# Altium project LEGO_SpeedChampion_Controller.PrjPcb
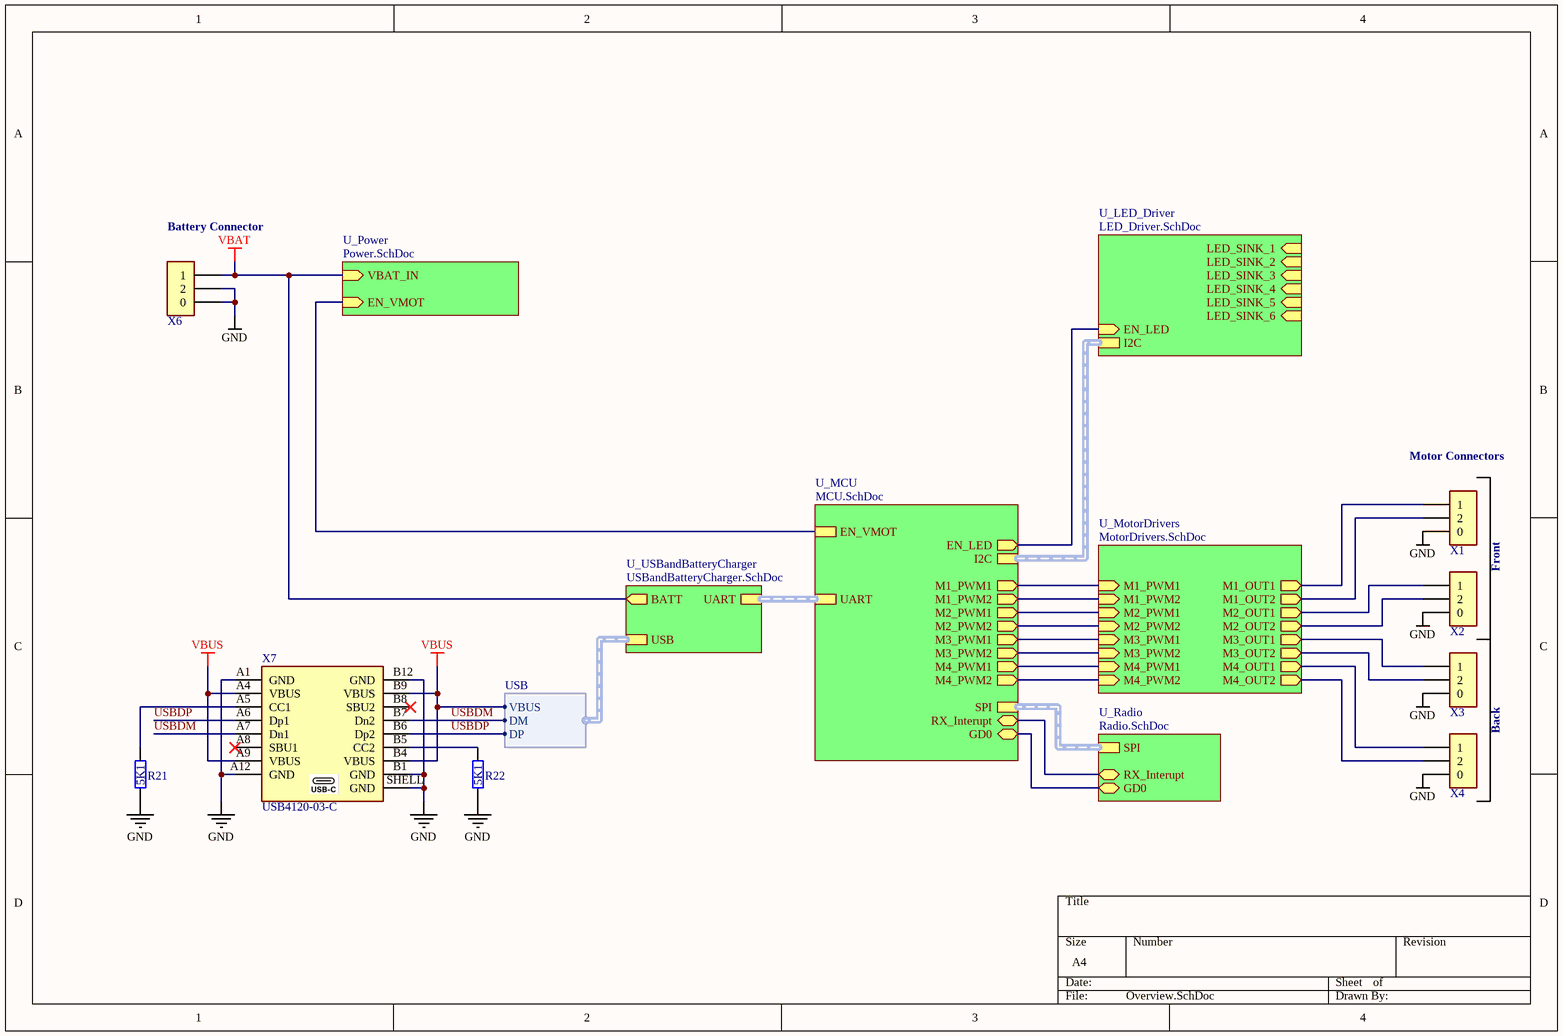
[diagram p0: Overview.SchDoc]
7 sheets, 105 parts. Net scope: hierarchical (ports join the sheet entries above them; power ports are global).
Board file: PCB.PcbDoc
Sheets:
  Overview.SchDoc
    U_Radio = Radio.SchDoc
    U_MCU = MCU.SchDoc
    U_Power = Power.SchDoc
    U_USBandBatteryCharger = USBandBatteryCharger.SchDoc
    U_MotorDrivers = MotorDrivers.SchDoc
    U_LED_Driver = LED_Driver.SchDoc

## Sheet Overview.SchDoc
size A4; SheetNumber: 1; SheetTotal: 7

### Parts
R21  5K1  [0603]  (value not drawn)
R22  5K1  [0603]  (value not drawn)
X1  BM02B-SRSS-TB  [BM02B-SRSS-TB]  (value not drawn)
X2  BM02B-SRSS-TB  [BM02B-SRSS-TB]  (value not drawn)
X3  BM02B-SRSS-TB  [BM02B-SRSS-TB]  (value not drawn)
X4  BM02B-SRSS-TB  [BM02B-SRSS-TB]  (value not drawn)
X6  BM02B-SRSS-TB  [BM02B-SRSS-TB]  (value not drawn)
X7  USB4120-03-C  [USB4120]

### Sub-sheets
U_LED_Driver = LED_Driver.SchDoc: LED_SINK_1 (in), LED_SINK_2 (in), LED_SINK_3 (in), LED_SINK_4 (in), LED_SINK_5 (in), LED_SINK_6 (in), EN_LED (in), I2C (harness I2C)
U_MCU = MCU.SchDoc: SPI (harness SPI), UART (harness UART), M1_PWM1 (out), M1_PWM2 (out), M2_PWM1 (out), M2_PWM2 (out), M3_PWM1 (out), M3_PWM2 (out), M4_PWM1 (out), M4_PWM2 (out), EN_VMOT, RX_Interupt (bidir), GD0 (bidir), I2C, EN_LED (out)
U_MotorDrivers = MotorDrivers.SchDoc: M1_PWM1 (in), M1_PWM2 (in), M2_PWM1 (in), M2_PWM2 (in), M3_PWM1 (in), M3_PWM2 (in), M4_PWM1 (in), M4_PWM2 (in), M1_OUT1 (out), M1_OUT2 (out), M2_OUT1 (out), M2_OUT2 (out), M3_OUT1 (out), M3_OUT2 (out), M4_OUT1 (out), M4_OUT2 (out)
U_Power = Power.SchDoc: VBAT_IN (in), EN_VMOT (in)
U_Radio = Radio.SchDoc: SPI (harness SPI), RX_Interupt (bidir), GD0 (bidir)
U_USBandBatteryCharger = USBandBatteryCharger.SchDoc: UART (harness UART), USB (harness USB), BATT (out)

### Harnesses
USB: VBUS, DP, DM

### Nets
GND: R21.1 R22.1 X1.0 X2.0 X3.0 X4.0 X6.0 X6.2 X7.A1(GND) X7.A12(GND) X7.B1(GND) X7.B12(GND) X7.SHELL(GND)
VBAT: X6.1 ; sheet U_Power/VBAT_IN, sheet U_USBandBatteryCharger/BATT
VBUS: X7.A4(VBUS) X7.A9(VBUS) X7.B4(VBUS) X7.B9(VBUS) ; sheet U_USBandBatteryCharger/USB.VBUS
M1_IN1: sheet U_MCU/M1_PWM1, sheet U_MotorDrivers/M1_PWM1
M1_IN2: sheet U_MCU/M1_PWM2, sheet U_MotorDrivers/M1_PWM2
M2_IN1: sheet U_MCU/M2_PWM1, sheet U_MotorDrivers/M2_PWM1
M2_IN2: sheet U_MCU/M2_PWM2, sheet U_MotorDrivers/M2_PWM2
M3_IN1: sheet U_MCU/M3_PWM1, sheet U_MotorDrivers/M3_PWM1
M3_IN2: sheet U_MCU/M3_PWM2, sheet U_MotorDrivers/M3_PWM2
M4_IN1: sheet U_MCU/M4_PWM1, sheet U_MotorDrivers/M4_PWM1
M4_IN2: sheet U_MCU/M4_PWM2, sheet U_MotorDrivers/M4_PWM2
USBDM: X7.A7(Dn1) X7.B7(Dn2) ; sheet U_USBandBatteryCharger/USB.DM
USBDP: X7.A6(Dp1) X7.B6(Dp2) ; sheet U_USBandBatteryCharger/USB.DP
NetIC1_2: X1.2 ; sheet U_MotorDrivers/M1_OUT2
NetIC1_3: X1.1 ; sheet U_MotorDrivers/M1_OUT1
NetIC2_2: X2.2 ; sheet U_MotorDrivers/M2_OUT2
NetIC2_3: X2.1 ; sheet U_MotorDrivers/M2_OUT1
NetIC3_2: X3.2 ; sheet U_MotorDrivers/M3_OUT2
NetIC3_3: X3.1 ; sheet U_MotorDrivers/M3_OUT1
NetIC4_2: X4.2 ; sheet U_MotorDrivers/M4_OUT2
NetIC4_3: X4.1 ; sheet U_MotorDrivers/M4_OUT1
NetIC5_3: sheet U_Radio/RX_Interupt, sheet U_MCU/RX_Interupt
NetIC5_6: sheet U_Radio/GD0, sheet U_MCU/GD0
NetIC6_1: sheet U_MCU/EN_VMOT, sheet U_Power/EN_VMOT
NetIC6_20: sheet U_MCU/EN_LED, sheet U_LED_Driver/EN_LED
NetR21_2: R21.2 X7.A5(CC1)
NetR22_2: R22.2 X7.B5(CC2)

Not connected (* = marked no-connect by the designer): X7 A8(SBU1)* B8(SBU2)*

### Buses and harness runs
harness sheet U_LED_Driver/I2C = sheet U_MCU/I2C
harness sheet U_MCU/SPI = sheet U_Radio/SPI
harness sheet U_MCU/UART = sheet U_USBandBatteryCharger/UART

### Notes on the sheet
- (near X6) Battery Connector
- (near X1) Motor Connectors
- Front
- Back

### Library data of the parts
R21 R22 = 000053: Part Number: 000053; Manufacturer: YAGEO; Manufacturer Partnummber: RC0603FR-075K1L; =Value: 10K; Component Type: Standard; ComponentLink1Description: Datasheet; ComponentLink2Description: Manufacturer Site; Value: 5K1; JLCPCB Part #: C23196
X1-X4 X6 = BM02B-SRSS-TB: Manufacturer: JST; Manufacturer Partnummber: BM02B-SRSS-TB
X7 = USB4120-03-C: Manufacturer: GCT; Manufacturer Partnummber: USB4120-03-C

## Sheet Radio.SchDoc
size A4; SheetNumber: 3; SheetTotal: 7
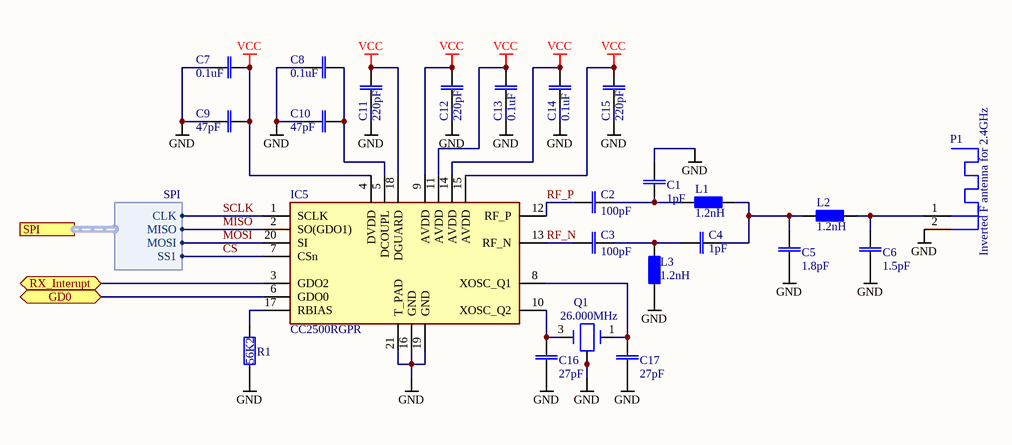
[diagram p1: Radio.SchDoc]

### Parts
C1  1pF  [CAP0402]
C2  100pF  [CAP0402]
C3  100pF  [CAP0402]
C4  1pF  [CAP0402]
C5  1.8pF  [CAP0402]
C6  1.5pF  [CAP0402]
C7  0.1uF  [CAP0402]
C8  0.1uF  [CAP0402]
C9  47pF  [CAP0402]
C10  47pF  [CAP0402]
C11  220pF  [CAP0402]
C12  220pF  [CAP0402]
C13  0.1uF  [CAP0402]
C14  0.1uF  [CAP0402]
C15  220pF  [CAP0402]
C16  27pF  [CAP0402]
C17  27pF  [CAP0402]
IC5  CC2500RGPR  [QFN20_4X4(CC2500)]
L1  1.2nH  [IND0402]
L2  1.2nH  [IND0402]
L3  1.2nH  [IND0402]
P1  Inverted F antenna for 2.4GHz  [Inverted_F_Antenna_2400MHZ]  (net tie, no BOM)
Q1  26.000MHz  [OSCCC322507]
R1  56K2  [RES0402]  (value not drawn)

### Ports
GD0 (bidir), RX_Interupt (bidir), SPI (harness SPI)

### Harnesses
SPI: MOSI, MISO, CLK, SS1

### Nets
GND: C1.1 C5.2 C6.2 C7.1 C8.1 C9.1 C10.1 C11.1 C12.1 C13.1 C14.1 C15.1 C16.2 C17.2 IC5.16(GND) IC5.19(GND) IC5.21(T_PAD) L3.1 P1.2(REF) Q1.2 Q1.4 R1.1
VCC: C7.2 C9.2 C11.2 C12.2 C13.2 C14.2 C15.2 IC5.4(DVDD) IC5.9(AVDD) IC5.11(AVDD) IC5.14(AVDD) IC5.15(AVDD) IC5.18(DGUARD)
CS: IC5.7(CSn) ; port SPI.SS1
MISO: IC5.2(SO(GDO1)) ; port SPI.MISO
MOSI: IC5.20(SI) ; port SPI.MOSI
RF_N: C3.1 IC5.13(RF_N)
RF_P: C2.1 IC5.12(RF_P)
SCLK: IC5.1(SCLK) ; port SPI.CLK
NetC1_2: C1.2 C2.2 L1.1
NetC3_2: C3.2 C4.2 L3.2
NetC4_1: C4.1 C5.1 L1.2 L2.1
NetC6_1: C6.1 L2.2 P1.1(FEED)
NetC8_2: C8.2 C10.2 IC5.5(DCOUPL)
NetC16_1: C16.1 IC5.10(XOSC_Q2) Q1.3
NetC17_1: C17.1 IC5.8(XOSC_Q1) Q1.1
NetIC5_3: IC5.3(GDO2) ; port RX_Interupt
NetIC5_6: IC5.6(GDO0) ; port GD0
NetIC5_17: IC5.17(RBIAS) R1.2

### Library data of the parts
C1 C4 = CAP_0402: Manufacturer: Samsung Electro-Mechanics; Manufacturer Partnummber: CL05C010CB5NNNC; Value: 1pF
C2 C3 = CAP_0402: Manufacturer: Samsung Electro-Mechanics; Manufacturer Partnummber: CL05C101JB5NNNC; Value: 100pF
C5 = CAP_0402: Manufacturer: Samsung Electro-Mechanics; Manufacturer Partnummber: CL05C1R8CC51PNC; Value: 1.8pF
C6 = CAP_0402: Manufacturer: Samsung Electro-Mechanics; Manufacturer Partnummber: CL05C1R5BB5NNNC; Value: 1.5pF
C7 C8 C13 C14 = CAP_0402: Manufacturer: Samsung Electro-Mechanics; Manufacturer Partnummber: CL05A104KA5NNNC; Value: 0.1uF
C9 C10 = CAP_0402: Manufacturer: Samsung Electro-Mechanics; Manufacturer Partnummber: CL05C470JB5NNNC; Value: 47pF
C11 C12 C15 = CAP_0402: Manufacturer: Samsung Electro-Mechanics; Manufacturer Partnummber: CL05C221JB5NNNC; Value: 220pF
C16 C17 = CAP_0402: Manufacturer: Samsung Electro-Mechanics; Manufacturer Partnummber: CL05C270JB5NNNC; Value: 27pF
IC5 = CC2500: Manufacturer: Texas Instruments; Manufacturer Partnummber: CC2500RGPR
L1-L3 = IND_0402: Manufacturer: Abracon LLC; Manufacturer Partnummber: ATFC-0402-1N2B-T; Value: 1.2nH
P1 = Antenna F 2400MHz
Q1 = ABM8G-26.000MHZ-18-D2Y-T: Manufacturer: Abracon LLC; Manufacturer Partnummber: ABM8G-26.000MHZ-18-D2Y-T
R1 = RES_0402: Manufacturer: YAGEO; Manufacturer Partnummber: RC0402FR-0756K2L; Value: 56K2

## Sheet MCU.SchDoc
size A4; SheetNumber: 2; SheetTotal: 7
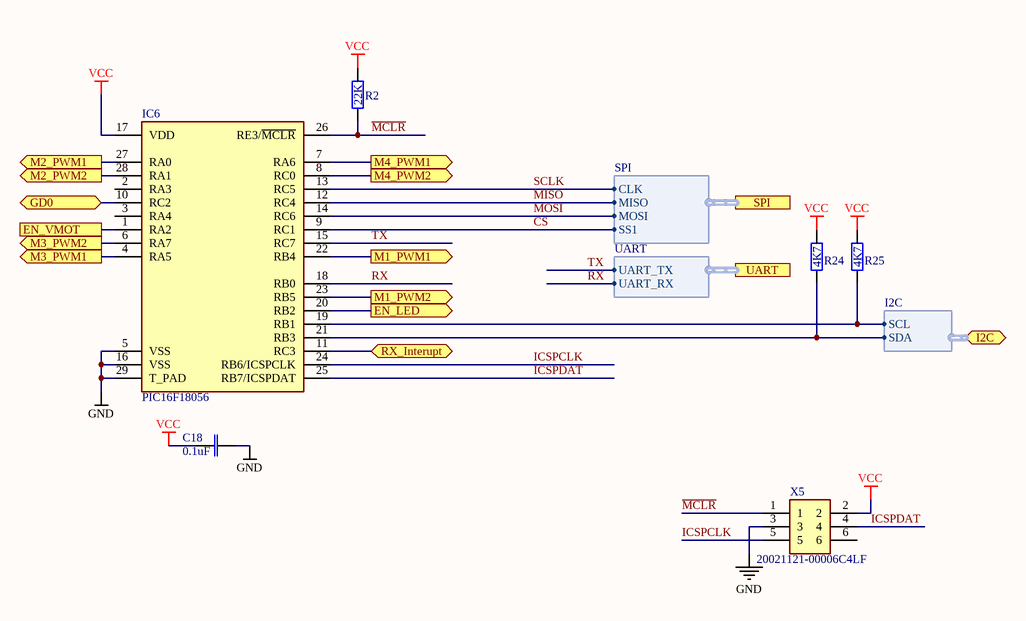
[diagram p2: MCU.SchDoc]

### Parts
C18  0.1uF  [CAP0402]
IC6  PIC16F18056  [QFN28_4X4(PIC16F18056)]
R2  22K  [RES0402]  (value not drawn)
R24  4K7  [RES0402]  (value not drawn)
R25  4K7  [RES0402]  (value not drawn)
X5  20021121-00006C4LF  [20021121-00X06CXLF]

### Ports
EN_LED (out), EN_VMOT, GD0 (bidir), I2C (bidir, harness I2C), M1_PWM1 (out), M1_PWM2 (out), M2_PWM1 (out), M2_PWM2 (out), M3_PWM1 (out), M3_PWM2 (out), M4_PWM1 (out), M4_PWM2 (out), RX_Interupt (bidir), SPI (harness SPI), UART (harness UART)

### Harnesses
SPI: MOSI, MISO, CLK, SS1
UART: UART_TX, UART_RX
I2C: SCL, SDA

### Nets
GND: C18.2 IC6.5(VSS) IC6.16(VSS) IC6.29(T_PAD) X5.3
VCC: C18.1 IC6.17(VDD) R2.2 R24.2 R25.2 X5.2
CS: IC6.9(RC1) ; port SPI.SS1
ICSPCLK: IC6.24(RB6/ICSPCLK) X5.5
ICSPDAT: IC6.25(RB7/ICSPDAT) X5.4
M1_IN1: IC6.22(RB4) ; port M1_PWM1
M1_IN2: IC6.23(RB5) ; port M1_PWM2
M2_IN1: IC6.27(RA0) ; port M2_PWM1
M2_IN2: IC6.28(RA1) ; port M2_PWM2
M3_IN1: IC6.4(RA5) ; port M3_PWM1
M3_IN2: IC6.6(RA7) ; port M3_PWM2
M4_IN1: IC6.7(RA6) ; port M4_PWM1
M4_IN2: IC6.8(RC0) ; port M4_PWM2
~{MCLR}: IC6.26(RE3/~{MCLR}) R2.1 X5.1
MISO: IC6.12(RC4) ; port SPI.MISO
MOSI: IC6.14(RC6) ; port SPI.MOSI
RX: IC6.18(RB0) ; port UART.UART_RX
SCLK: IC6.13(RC5) ; port SPI.CLK
TX: IC6.15(RC7) ; port UART.UART_TX
NetIC5_3: IC6.11(RC3) ; port RX_Interupt
NetIC5_6: IC6.10(RC2) ; port GD0
NetIC6_1: IC6.1(RA2) ; port EN_VMOT
NetIC6_19: IC6.19(RB1) R25.1 ; port I2C.SCL
NetIC6_20: IC6.20(RB2) ; port EN_LED
NetIC6_21: IC6.21(RB3) R24.1 ; port I2C.SDA

Not connected (* = marked no-connect by the designer): IC6 2(RA3) 3(RA4); X5 6

### Library data of the parts
C18 = CAP_0402: as C7 on sheet Radio; Value: 0.1uF
IC6 = PIC16F18056: Manufacturer: Microchip Technology; Manufacturer Partnummber: PIC16F18056-I/STX
R2 = RES_0402: Manufacturer: YAGEO; Manufacturer Partnummber: RC0402FR-0722KL; Value: 22K
R24 R25 = RES_0402: Manufacturer: YAGEO; Manufacturer Partnummber: RC0402FR-074K7L; Value: 4K7
X5 = 20021121-00006C4LF: Manufacturer: Amphenol ICC (FCI); JLCPCB Part #: C178291; Manufacturer Partnummber: 20021121-00006C4LF

## Sheet Power.SchDoc
size A4; SheetNumber: 4; SheetTotal: 7
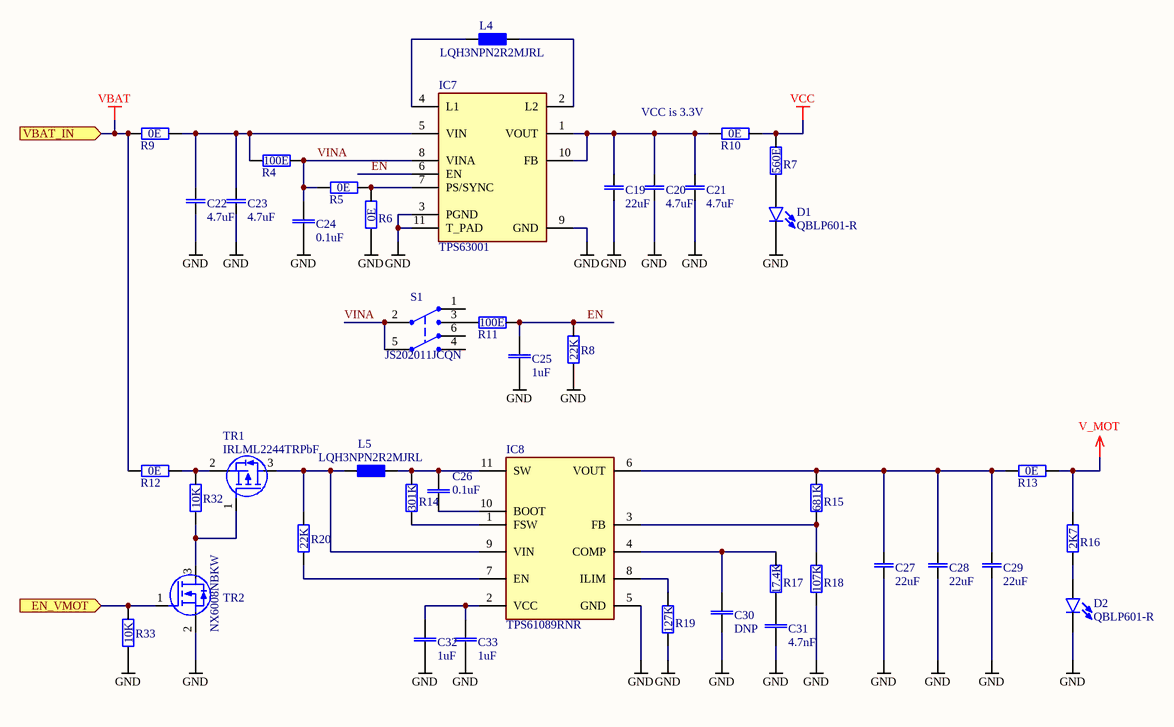
[diagram p3: Power.SchDoc]

### Parts
C19  22uF  [0805]
C20  4.7uF  [0805]
C21  4.7uF  [0805]
C22  4.7uF  [0805]
C23  4.7uF  [0805]
C24  0.1uF  [CAP0402]
C25  1uF  [CAP0402]
C26  0.1uF  [CAP0402]
C27  22uF  [0805]
C28  22uF  [0805]
C29  22uF  [0805]
C30  DNP  [CAP0402]
C31  4.7nF  [CAP0402]
C32  1uF  [CAP0402]
C33  1uF  [CAP0402]
D1  QBLP601-R  [LED0603]
D2  QBLP601-R  [LED0603]
IC7  TPS63001  [VSON10(TPS63001)]
IC8  TPS61089RNR  [VQFN12_HOTROD(TPS61089)]
L4  LQH3NPN2R2MJRL  [INDP3030X02N]
L5  LQH3NPN2R2MJRL  [INDP3030X02N]
R4  100E  [RES0402]  (value not drawn)
R5  0E  [RES0402]  (value not drawn)
R6  0E  [RES0402]  (value not drawn)
R7  560E  [RES0402]  (value not drawn)
R8  22K  [RES0402]  (value not drawn)
R9  0E  [RES0402]  (value not drawn)
R10  0E  [RES0402]  (value not drawn)
R11  100E  [RES0402]  (value not drawn)
R12  0E  [RES0402]  (value not drawn)
R13  0E  [RES0402]  (value not drawn)
R14  301K  [RES0402]  (value not drawn)
R15  681K  [RES0402]  (value not drawn)
R16  2K7  [RES0402]  (value not drawn)
R17  17.4K  [RES0402]  (value not drawn)
R18  107K  [RES0402]  (value not drawn)
R19  127K  [RES0402]  (value not drawn)
R20  22K  [RES0402]  (value not drawn)
R32  10K  [RES0402]  (value not drawn)
R33  10K  [RES0402]  (value not drawn)
S1  JS202011JCQN  [JS202011JCQN]
TR1  IRLML2244TRPbF  [SOT23(IRLM2244T)]
TR2  NX6008NBKW  [SOT323/SC-70(NX6008NBKW)]

### Ports
EN_VMOT (in), VBAT_IN (in)

### Nets
GND: C19.1 C20.1 C21.1 C22.1 C23.1 C24.1 C25.1 C27.1 C28.1 C29.1 C30.2 C31.2 C32.2 C33.2 D1.2 D2.2 IC7.3(PGND) IC7.9(GND) IC7.11(T_PAD) IC8.5(GND) R6.1 R8.1 R18.1 R19.1 R33.1 TR2.2(S)
V_MOT: R13.2 R16.2
VBAT: R9.1 R12.1 ; port VBAT_IN
VCC: R7.2 R10.2
EN: C25.2 IC7.6(EN) R8.2 R11.2
VINA: C24.2 IC7.8(VINA) R4.2 R5.1 S1.2 S1.5
NetC19_2: C19.2 C20.2 C21.2 IC7.1(VOUT) IC7.10(FB) R10.1
NetC22_2: C22.2 C23.2 IC7.5(VIN) R4.1 R9.2
NetC26_1: C26.1 IC8.10(BOOT)
NetC26_2: C26.2 IC8.11(SW) L5.2 R14.2
NetC27_2: C27.2 C28.2 C29.2 IC8.6(VOUT) R13.1 R15.2
NetC30_1: C30.1 IC8.4(COMP) R17.2
NetC31_1: C31.1 R17.1
NetC32_1: C32.1 C33.1 IC8.2(VCC)
NetD1_1: D1.1 R7.1
NetD2_1: D2.1 R16.1
NetIC6_1: R33.2 TR2.1(G) ; port EN_VMOT
NetIC7_2: IC7.2(L2) L4.2
NetIC7_4: IC7.4(L1) L4.1
NetIC7_7: IC7.7(PS/SYNC) R5.2 R6.2
NetIC8_1: IC8.1(FSW) R14.1
NetIC8_3: IC8.3(FB) R15.1 R18.2
NetIC8_7: IC8.7(EN) R20.1
NetIC8_8: IC8.8(ILIM) R19.2
NetIC8_9: IC8.9(VIN) L5.1 R20.2 TR1.3(D)
NetR11_1: R11.1 S1.3
NetR12_2: R12.2 R32.2 TR1.2(S)
NetR32_1: R32.1 TR1.1(G) TR2.3(D)

Not connected (* = marked no-connect by the designer): S1 1 4 6

### Notes on the sheet
- (near R10) VCC is 3.3V

### Library data of the parts
C19 C27-C29 = 000095: Part Number: 000095; Manufacturer: Murata Electronics; Manufacturer Partnummber: GRM21BR61E226ME44K; Component Type: Standard; ComponentLink1Description: Datasheet; ComponentLink2Description: Manufacturer Site; Value: 22uF; Digikey Number: 490-14661-1-ND
C20-C23 = 000090: Part Number: 000090; Manufacturer: Samsung Electro-Mechanics; Manufacturer Partnummber: CL21A475KOFNNNE; Component Type: Standard; ComponentLink1Description: Datasheet; ComponentLink2Description: Manufacturer Site; Value: 4.7uF; Digikey Number: 1276-1065-1-ND
C24 C26 = CAP_0402: as C7 on sheet Radio; Value: 0.1uF
C25 C32 C33 = CAP_0402: Manufacturer: Samsung Electro-Mechanics; Manufacturer Partnummber: CL05A105KO5NNNC; Value: 1uF
C30 = CAP_0402: Value: DNP
C31 = CAP_0402: Manufacturer: Samsung Electro-Mechanics; Manufacturer Partnummber: CL05B472KB5VPNC; Value: 4.7nF
D1 D2 = QBLP601-R: Manufacturer: QT Brightek (QTB); Manufacturer Partnummber: QBLP601-R
IC7 = TPS63001: Manufacturer: Texas Instruments; Manufacturer Partnummber: TPS63001DRCR
IC8 = TPS61089: Manufacturer: Texas Instruments; Manufacturer Partnummber: TPS61089RNRR
L4 L5 = LQH3NPN2R2MJRL: Manufacturer: Murata Electronics; Value: LQH3NPN2R2MJRL; MPN: LQH3NPN2R2MJRL; Manufacturer Partnummber: LQH3NPN2R2MJRL
R4 R11 = RES_0402: Manufacturer: YAGEO; Manufacturer Partnummber: RC0402FR-07100RL; Value: 100E
R5 R6 R9 R10 R12 R13 = RES_0402: Manufacturer: YAGEO; Manufacturer Partnummber: RC0402JR-070RL; Value: 0E
R7 = RES_0402: Manufacturer: YAGEO; Manufacturer Partnummber: RC0402FR-07560RL; Value: 560E
R8 R20 = RES_0402: as R2 on sheet MCU; Value: 22K
R14 = RES_0402: Manufacturer: YAGEO; Manufacturer Partnummber: RC0402FR-07301KL; Value: 301K
R15 = RES_0402: Manufacturer: YAGEO; Manufacturer Partnummber: RC0402FR-07681KL; Value: 681K
R16 = RES_0402: Manufacturer: YAGEO; Manufacturer Partnummber: RC0402FR-072K7L; Value: 2K7
R17 = RES_0402: Manufacturer: YAGEO; Manufacturer Partnummber: RC0402FR-0717K4L; Value: 17.4K
R18 = RES_0402: Manufacturer: YAGEO; Manufacturer Partnummber: RC0402FR-07107KL; Value: 107K
R19 = RES_0402: Manufacturer: YAGEO; Manufacturer Partnummber: RC0402FR-07127KL; Value: 127K
R32 R33 = RES_0402: Manufacturer: YAGEO; Manufacturer Partnummber: RC0402FR-0710KL; Value: 10K
S1 = JS202011JCQN: Manufacturer: C&K; Manufacturer Partnummber: JS202011JCQN
TR1 = IRLML2244TRPbF: Manufacturer: Infineon Technologies; Value: IRLML2244TRPbF; Manufacturer Partnummber: IRLML2244TRPBF
TR2 = NX6008NBKW: Value: NX6008NBKW

## Sheet USBandBatteryCharger.SchDoc
size A4; SheetNumber: 5; SheetTotal: 7
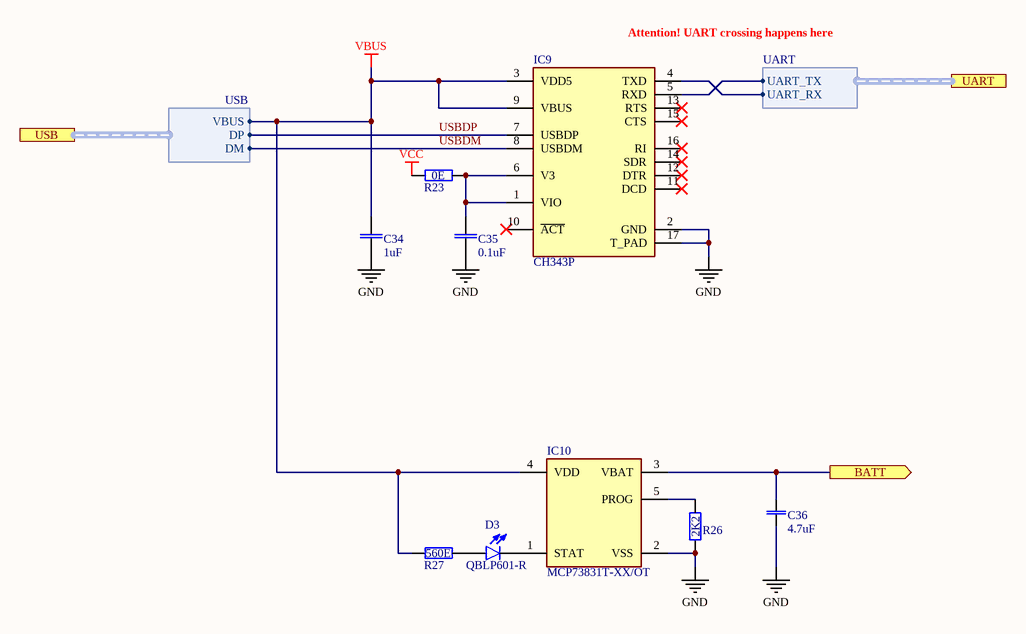
[diagram p4: USBandBatteryCharger.SchDoc]

### Parts
C34  1uF  [CAP0402]
C35  0.1uF  [CAP0402]
C36  4.7uF  [0805]
D3  QBLP601-R  [LED0603]
IC9  CH343P  [QFN16_3X3]
IC10  MCP73831T-XX/OT  [SOT23-5(MCP73831)]
R23  0E  [RES0402]  (value not drawn)
R26  2K2  [RES0402]  (value not drawn)
R27  560E  [RES0402]  (value not drawn)

### Ports
BATT (out), UART (harness UART), USB (harness USB)

### Harnesses
UART: UART_TX, UART_RX
USB: VBUS, DP, DM

### Nets
GND: C34.2 C35.1 C36.1 IC9.2(GND) IC9.17(T_PAD) IC10.2(VSS) R26.1
VBAT: C36.2 IC10.3(VBAT) ; port BATT
VBUS: C34.1 IC9.3(VDD5) IC9.9(VBUS) IC10.4(VDD) R27.1 ; port USB.VBUS
VCC: R23.1
RX: IC9.4(TXD) ; port UART.UART_RX
TX: IC9.5(RXD) ; port UART.UART_TX
USBDM: IC9.8(USBDM) ; port USB.DM
USBDP: IC9.7(USBDP) ; port USB.DP
NetC35_2: C35.2 IC9.1(VIO) IC9.6(V3) R23.2
NetD3_1: D3.1 R27.2
NetD3_2: D3.2 IC10.1(STAT)
NetIC10_5: IC10.5(PROG) R26.2

Not connected (* = marked no-connect by the designer): IC9 10(~{ACT})* 11(DCD)* 12(DTR)* 13(RTS)* 14(SDR)* 15(CTS)* 16(RI)*

### Notes on the sheet
- (near IC9) Attention! UART crossing happens here

### Library data of the parts
C34 = CAP_0402: as C25 on sheet Power; Value: 1uF
C35 = CAP_0402: as C7 on sheet Radio; Value: 0.1uF
C36 = 000090: as C20 on sheet Power; Component Type: Standard; ComponentLink1Description: Datasheet; ComponentLink2Description: Manufacturer Site; Value: 4.7uF; Digikey Number: 1276-1065-1-ND
D3 = QBLP601-R: Manufacturer: QT Brightek (QTB); Manufacturer Partnummber: QBLP601-R
IC9 = CH343P: Manufacturer: WCH; JLCPCB Part #: C2846043; Manufacturer Partnummber: CH343P
IC10 = MCP73831: Manufacturer: Microchip Technology; Manufacturer Partnummber: MCP73831T-2ACI/OT
R23 = RES_0402: as R5 on sheet Power; Value: 0E
R26 = RES_0402: Manufacturer: YAGEO; Manufacturer Partnummber: RC0402FR-072K2L; Value: 2K2
R27 = RES_0402: as R7 on sheet Power; Value: 560E

## Sheet MotorDrivers.SchDoc
size A4; SheetNumber: 6; SheetTotal: 7
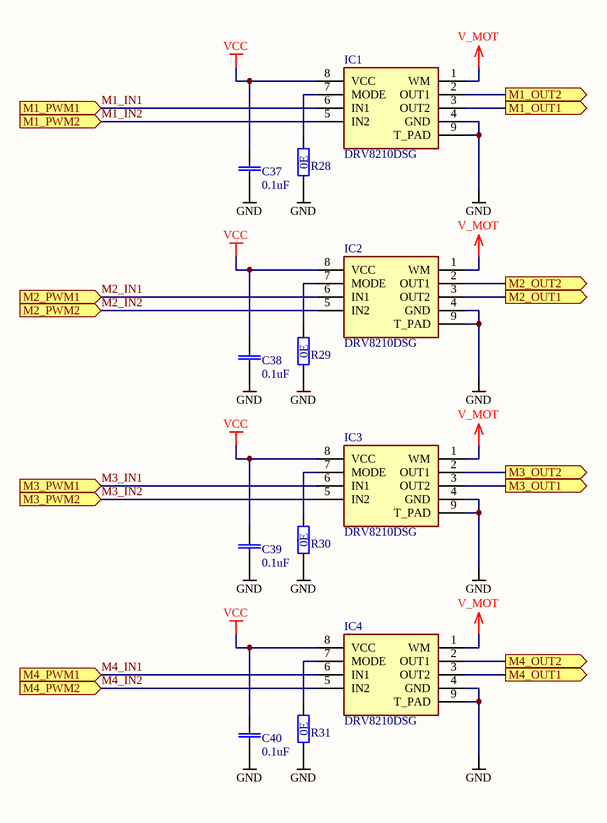
[diagram p5: MotorDrivers.SchDoc]

### Parts
C37  0.1uF  [CAP0402]
C38  0.1uF  [CAP0402]
C39  0.1uF  [CAP0402]
C40  0.1uF  [CAP0402]
IC1  DRV8210DSG  [WSON8(DRV8210)]
IC2  DRV8210DSG  [WSON8(DRV8210)]
IC3  DRV8210DSG  [WSON8(DRV8210)]
IC4  DRV8210DSG  [WSON8(DRV8210)]
R28  0E  [RES0402]  (value not drawn)
R29  0E  [RES0402]  (value not drawn)
R30  0E  [RES0402]  (value not drawn)
R31  0E  [RES0402]  (value not drawn)

### Ports
M1_OUT1 (out), M1_OUT2 (out), M1_PWM1 (in), M1_PWM2 (in), M2_OUT1 (out), M2_OUT2 (out), M2_PWM1 (in), M2_PWM2 (in), M3_OUT1 (out), M3_OUT2 (out), M3_PWM1 (in), M3_PWM2 (in), M4_OUT1 (out), M4_OUT2 (out), M4_PWM1 (in), M4_PWM2 (in)

### Nets
GND: C37.1 C38.1 C39.1 C40.1 IC1.4(GND) IC1.9(T_PAD) IC2.4(GND) IC2.9(T_PAD) IC3.4(GND) IC3.9(T_PAD) IC4.4(GND) IC4.9(T_PAD) R28.1 R29.1 R30.1 R31.1
V_MOT: IC1.1(WM) IC2.1(WM) IC3.1(WM) IC4.1(WM)
VCC: C37.2 C38.2 C39.2 C40.2 IC1.8(VCC) IC2.8(VCC) IC3.8(VCC) IC4.8(VCC)
M1_IN1: IC1.6(IN1) ; port M1_PWM1
M1_IN2: IC1.5(IN2) ; port M1_PWM2
M2_IN1: IC2.6(IN1) ; port M2_PWM1
M2_IN2: IC2.5(IN2) ; port M2_PWM2
M3_IN1: IC3.6(IN1) ; port M3_PWM1
M3_IN2: IC3.5(IN2) ; port M3_PWM2
M4_IN1: IC4.6(IN1) ; port M4_PWM1
M4_IN2: IC4.5(IN2) ; port M4_PWM2
NetIC1_2: IC1.2(OUT1) ; port M1_OUT2
NetIC1_3: IC1.3(OUT2) ; port M1_OUT1
NetIC1_7: IC1.7(MODE) R28.2
NetIC2_2: IC2.2(OUT1) ; port M2_OUT2
NetIC2_3: IC2.3(OUT2) ; port M2_OUT1
NetIC2_7: IC2.7(MODE) R29.2
NetIC3_2: IC3.2(OUT1) ; port M3_OUT2
NetIC3_3: IC3.3(OUT2) ; port M3_OUT1
NetIC3_7: IC3.7(MODE) R30.2
NetIC4_2: IC4.2(OUT1) ; port M4_OUT2
NetIC4_3: IC4.3(OUT2) ; port M4_OUT1
NetIC4_7: IC4.7(MODE) R31.2

### Library data of the parts
C37-C40 = CAP_0402: as C7 on sheet Radio; Value: 0.1uF
IC1-IC4 = DRV8210DSG: Manufacturer: Texas Instruments; Manufacturer Partnummber: DRV8210DSGR
R28-R31 = RES_0402: as R5 on sheet Power; Value: 0E

## Sheet LED_Driver.SchDoc
size A4; SheetNumber: 7; SheetTotal: 7
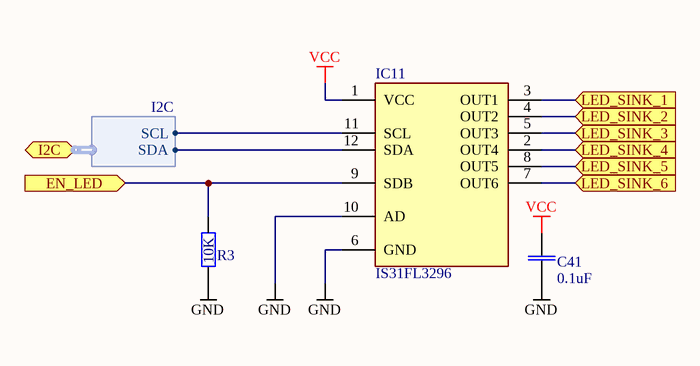
[diagram p6: LED_Driver.SchDoc]

### Parts
C41  0.1uF  [CAP0402]
IC11  IS31FL3296  [QFN12-2X2(IS31FL3296)]
R3  10K  [RES0402]  (value not drawn)

### Ports
EN_LED (in), I2C (bidir, harness I2C), LED_SINK_1 (in), LED_SINK_2 (in), LED_SINK_3 (in), LED_SINK_4 (in), LED_SINK_5 (in), LED_SINK_6 (in)

### Harnesses
I2C: SCL, SDA

### Nets
GND: C41.1 IC11.6(GND) IC11.10(AD) R3.1
VCC: C41.2 IC11.1(VCC)
NetIC6_19: IC11.11(SCL) ; port I2C.SCL
NetIC6_20: IC11.9(SDB) R3.2 ; port EN_LED
NetIC6_21: IC11.12(SDA) ; port I2C.SDA
NetIC11_2: IC11.2(OUT4) ; port LED_SINK_4
NetIC11_3: IC11.3(OUT1) ; port LED_SINK_1
NetIC11_4: IC11.4(OUT2) ; port LED_SINK_2
NetIC11_5: IC11.5(OUT3) ; port LED_SINK_3
NetIC11_7: IC11.7(OUT6) ; port LED_SINK_6
NetIC11_8: IC11.8(OUT5) ; port LED_SINK_5

### Library data of the parts
C41 = CAP_0402: as C7 on sheet Radio; Value: 0.1uF
IC11 = IS31FL3296: Manufacturer: Lumissil Microsystems; Manufacturer Partnummber: IS31FL3296-UTLS4-TR
R3 = RES_0402: as R32 on sheet Power; Value: 10K

## Nets that join several sheets
GND: Overview (13 pins), Radio (22 pins), MCU (5 pins), Power (26 pins), USBandBatteryCharger (7 pins), MotorDrivers (16 pins), LED_Driver (C41.1 IC11.6 IC11.10 R3.1)
V_MOT: Power (R13.2 R16.2), MotorDrivers (IC1.1 IC2.1 IC3.1 IC4.1)
VBAT: Overview (X6.1), Power (R9.1 R12.1), USBandBatteryCharger (C36.2 IC10.3)
VBUS: Overview (X7.A4 X7.A9 X7.B4 X7.B9), USBandBatteryCharger (5 pins)
VCC: Radio (13 pins), MCU (6 pins), Power (R7.2 R10.2), USBandBatteryCharger (R23.1), MotorDrivers (8 pins), LED_Driver (C41.2 IC11.1)
CS: Radio (IC5.7), MCU (IC6.9)
M1_IN1: MCU (IC6.22), MotorDrivers (IC1.6)
M1_IN2: MCU (IC6.23), MotorDrivers (IC1.5)
M2_IN1: MCU (IC6.27), MotorDrivers (IC2.6)
M2_IN2: MCU (IC6.28), MotorDrivers (IC2.5)
M3_IN1: MCU (IC6.4), MotorDrivers (IC3.6)
M3_IN2: MCU (IC6.6), MotorDrivers (IC3.5)
M4_IN1: MCU (IC6.7), MotorDrivers (IC4.6)
M4_IN2: MCU (IC6.8), MotorDrivers (IC4.5)
MISO: Radio (IC5.2), MCU (IC6.12)
MOSI: Radio (IC5.20), MCU (IC6.14)
NetIC1_2: Overview (X1.2), MotorDrivers (IC1.2)
NetIC1_3: Overview (X1.1), MotorDrivers (IC1.3)
NetIC2_2: Overview (X2.2), MotorDrivers (IC2.2)
NetIC2_3: Overview (X2.1), MotorDrivers (IC2.3)
NetIC3_2: Overview (X3.2), MotorDrivers (IC3.2)
NetIC3_3: Overview (X3.1), MotorDrivers (IC3.3)
NetIC4_2: Overview (X4.2), MotorDrivers (IC4.2)
NetIC4_3: Overview (X4.1), MotorDrivers (IC4.3)
NetIC5_3: Radio (IC5.3), MCU (IC6.11)
NetIC5_6: Radio (IC5.6), MCU (IC6.10)
NetIC6_1: MCU (IC6.1), Power (R33.2 TR2.1)
NetIC6_19: MCU (IC6.19 R25.1), LED_Driver (IC11.11)
NetIC6_20: MCU (IC6.20), LED_Driver (IC11.9 R3.2)
NetIC6_21: MCU (IC6.21 R24.1), LED_Driver (IC11.12)
RX: MCU (IC6.18), USBandBatteryCharger (IC9.4)
SCLK: Radio (IC5.1), MCU (IC6.13)
TX: MCU (IC6.15), USBandBatteryCharger (IC9.5)
USBDM: Overview (X7.A7 X7.B7), USBandBatteryCharger (IC9.8)
USBDP: Overview (X7.A6 X7.B6), USBandBatteryCharger (IC9.7)